# Altium schematic sheet press.SchDoc
size A4
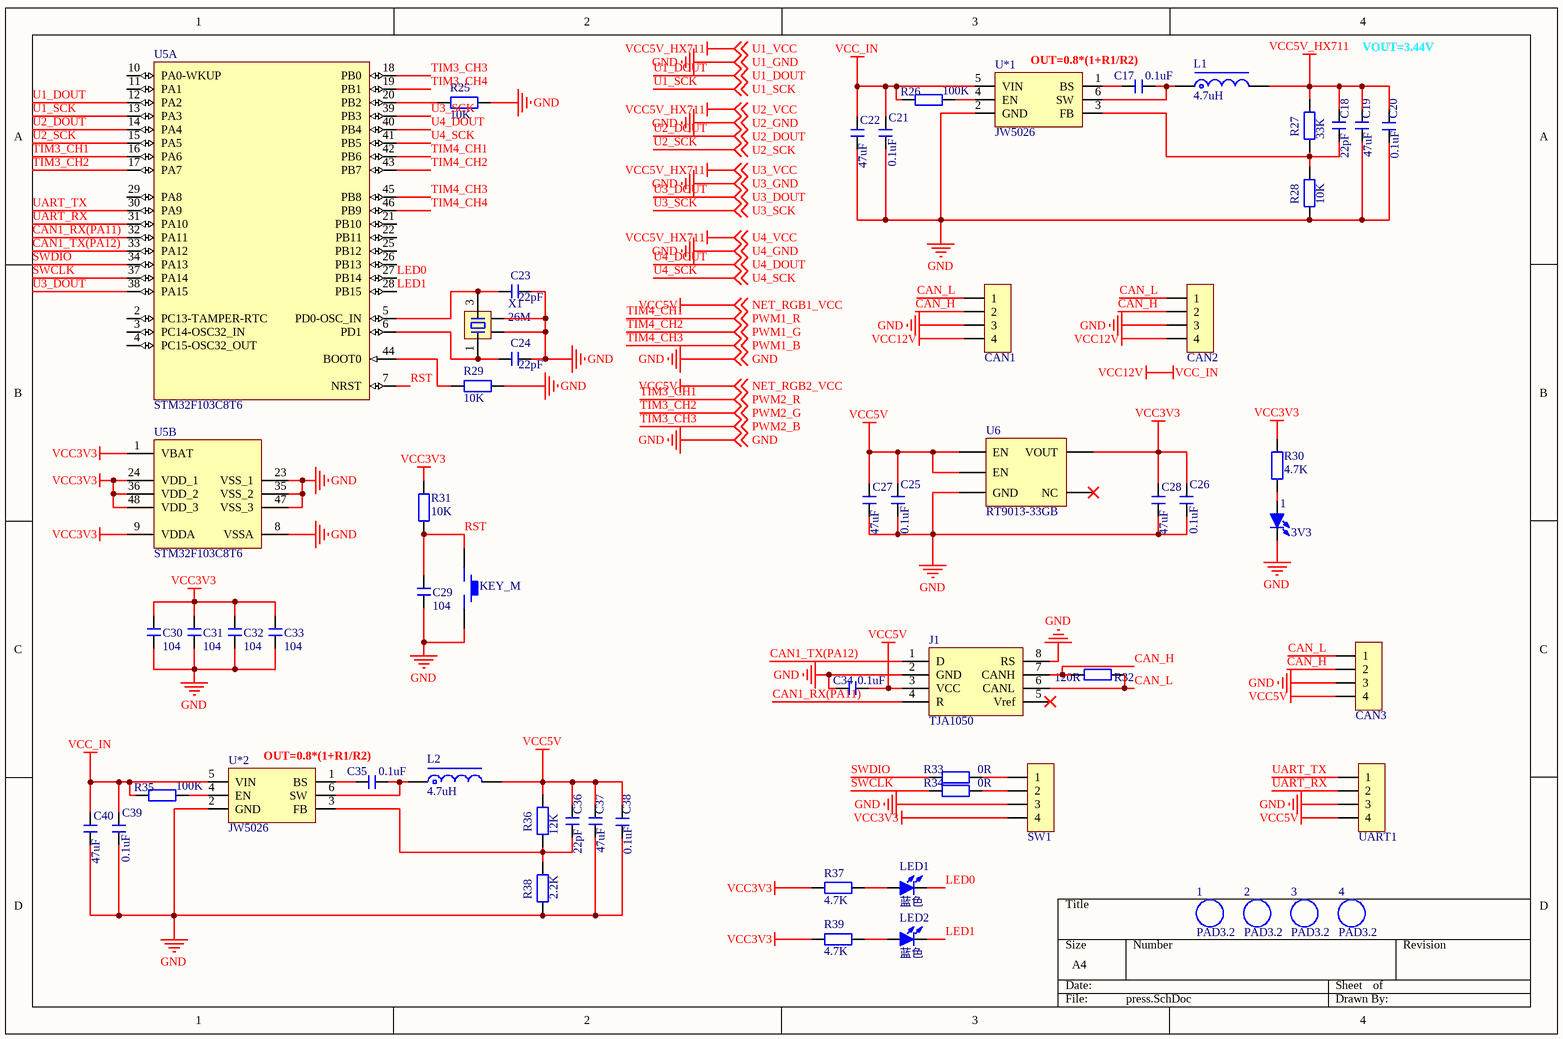
[diagram p0: press.SchDoc]

## Parts
(Parts that share a designator on the sheet are numbered #1, #2 ... from top to bottom, then left to right.)
1#1  3V3  [LED 0805R]
1#2  PAD3.2  [PAD3.2]
2  PAD3.2  [PAD3.2]
3  PAD3.2  [PAD3.2]
4  PAD3.2  [PAD3.2]
C17  0.1uF  [C 0603_L]
C18  22pF  [C 0603_L]
C19  47uF  [C 0805_L]
C20  0.1uF  [C 0805_L]
C21  0.1uF  [C 0805_L]
C22  47uF  [C 0805_L]
C23  22pF  [C 0603_L]
C24  22pF  [C 0603_L]
C25  0.1uF  [C 0805_L]
C26  0.1uF  [C 0805_L]
C27  47uF  [C 0805_L]
C28  47uF  [C 0805_L]
C29  104  [C 0603_L]
C30  104  [C 0603_L]
C31  104  [C 0603_L]
C32  104  [C 0603_L]
C33  104  [C 0603_L]
C34  0.1uF  [C 0603_L]
C35  0.1uF  [C 0603_L]
C36  22pF  [C 0603_L]
C37  47uF  [C 0805_L]
C38  0.1uF  [C 0805_L]
C39  0.1uF  [C 0805_L]
C40  47uF  [C 0805_L]
CAN1  HDR-1X4  [MX 1.25-WS-4P]  (value not drawn)
CAN2  HDR-1X4  [MX 1.25-WS-4P]  (value not drawn)
CAN3  HDR-1X4  [MX 1.25-WS-4P]  (value not drawn)
J1  TJA1050  [SOIC-8_150mil]
L1  4.7uH  [CD53]
L2  4.7uH  [CD53]
LED1  蓝色  [LED 0805B]
LED2  蓝色  [LED 0805B]
R25  10K  [R 0603_L]
R26  100K  [R 0603_L]
R27  33K  [R 0603_L]
R28  10K  [R 0603_L]
R29  10K  [R 0603_L]
R30  4.7K  [R 0603_L]
R31  10K  [R 0603_L]
R32  120R  [R 0603_L]
R33  0R  [R 0603_L]
R34  0R  [R 0603_L]
R35  100K  [R 0603_L]
R36  12K  [R 0603_L]
R37  4.7K  [R 0603_L]
R38  2.2K  [R 0603_L]
R39  4.7K  [R 0603_L]
RST1  KEY_M  [SMD-3.2*4.2]
SW1  HDR-1X4  [MX 1.25-WS-4P]  (value not drawn)
U5  STM32F103C8T6  [LQFP48_N]  (parts A,B of 2)
U6  RT9013-33GB  [SOT23-5M]
U*1  JW5026  [SOT-23-6_L2.9-W1.6-P0.95-LS2.8-BL]
U*2  JW5026  [SOT-23-6_L2.9-W1.6-P0.95-LS2.8-BL]
UART1  HDR-1X4  [MX 1.25-WS-4P]  (value not drawn)
X1  26M  [OSC 3225-4P]

## Nets
GND: 1#1.2(K) C19.1 C20.1 C21.1 C22.1 C23.2 C24.2 C25.1 C26.1 C27.1 C28.1 C29.1 C30.1 C31.1 C32.1 C33.1 C34.2 C37.1 C38.1 C39.1 C40.1 CAN1.3 CAN2.3 CAN3.3 J1.2(GND) J1.8(RS) R25.2 R28.1 R29.2 R38.1 RST1.2 SW1.3 U5.8(VSSA) U5.23(VSS_1) U5.35(VSS_2) U5.47(VSS_3) U6.2(GND) U*1.2(GND) U*2.2(GND) UART1.3 X1.2 X1.4 ; off-sheet U1_GND, off-sheet U2_GND, off-sheet U3_GND, off-sheet U4_GND, off-sheet GND  [also labelled U1_GND, U2_GND, U3_GND, U4_GND]
VCC3V3: C26.2 C28.2 C30.2 C31.2 C32.2 C33.2 R30.1 R31.2 R37.1 R39.1 SW1.4 U5.1(VBAT) U5.9(VDDA) U5.24(VDD_1) U5.36(VDD_2) U5.48(VDD_3) U6.5(VOUT)
VCC5V: C25.2 C27.2 C34.1 C36.2 C37.2 C38.2 CAN3.4 J1.3(VCC) L2.2 R36.2 U6.1(EN) U6.3(EN) UART1.4 ; off-sheet NET_RGB1_VCC, off-sheet NET_RGB2_VCC  [also labelled NET_RGB1_VCC, NET_RGB2_VCC]
VCC5V_HX711: C18.2 C19.2 C20.2 L1.2 R27.2 ; off-sheet U1_VCC, off-sheet U2_VCC, off-sheet U3_VCC, off-sheet U4_VCC  [also labelled U1_VCC, U2_VCC, U3_VCC, U4_VCC]
VCC12V: C21.2 C22.2 C39.2 C40.2 CAN1.4 CAN2.4 R26.2 R35.2 U*1.5(VIN) U*2.5(VIN)  [also labelled VCC_IN]
CAN1_RX(PA11): J1.4(R) U5.32(PA11)
CAN1_TX(PA12): J1.1(D) U5.33(PA12)
CAN_H: CAN1.2 CAN2.2 CAN3.2 J1.7(CANH) R32.1
CAN_L: CAN1.1 CAN2.1 CAN3.1 J1.6(CANL) R32.2
LED0: LED1.2(K) U5.27(PB14)
LED1: LED2.2(K) U5.28(PB15)
RST: C29.2 R31.1 RST1.1 U5.7(NRST)
SWCLK: R34.1 U5.37(PA14)
SWDIO: R33.1 U5.34(PA13)
TIM3_CH1: U5.16(PA6) ; off-sheet PWM2_R  [also labelled PWM2_R]
TIM3_CH2: U5.17(PA7) ; off-sheet PWM2_G  [also labelled PWM2_G]
TIM3_CH3: U5.18(PB0) ; off-sheet PWM2_B  [also labelled PWM2_B]
TIM3_CH4: U5.19(PB1)
TIM4_CH1: U5.42(PB6) ; off-sheet PWM1_R  [also labelled PWM1_R]
TIM4_CH2: U5.43(PB7) ; off-sheet PWM1_G  [also labelled PWM1_G]
TIM4_CH3: U5.45(PB8) ; off-sheet PWM1_B  [also labelled PWM1_B]
TIM4_CH4: U5.46(PB9)
U1_DOUT: U5.12(PA2) ; off-sheet U1_DOUT
U1_SCK: U5.13(PA3) ; off-sheet U1_SCK
U2_DOUT: U5.14(PA4) ; off-sheet U2_DOUT
U2_SCK: U5.15(PA5) ; off-sheet U2_SCK
U3_DOUT: U5.38(PA15) ; off-sheet U3_DOUT
U3_SCK: U5.39(PB3) ; off-sheet U3_SCK
U4_DOUT: U5.40(PB4) ; off-sheet U4_DOUT
U4_SCK: U5.41(PB5) ; off-sheet U4_SCK
UART_RX: U5.31(PA10) UART1.2
UART_TX: U5.30(PA9) UART1.1
Net1#1_1: 1#1.1(A) R30.2
NetC17_1: C17.1 U*1.1(BS)
NetC17_2: C17.2 L1.1 U*1.6(SW)
NetC18_1: C18.1 R27.1 R28.2 U*1.3(FB)
NetC23_1: C23.1 U5.5(PD0-OSC_IN) X1.3
NetC24_1: C24.1 U5.6(PD1) X1.1
NetC35_1: C35.1 U*2.1(BS)
NetC35_2: C35.2 L2.1 U*2.6(SW)
NetC36_1: C36.1 R36.1 R38.2 U*2.3(FB)
NetLED1_1: LED1.1(A) R37.2
NetLED2_1: LED2.1(A) R39.2
NetR25_1: R25.1 U5.20(PB2)
NetR26_1: R26.1 U*1.4(EN)
NetR29_1: R29.1 U5.44(BOOT0)
NetR33_2: R33.2 SW1.1
NetR34_2: R34.2 SW1.2
NetR35_1: R35.1 U*2.4(EN)

Not connected (* = marked no-connect by the designer): J1 5(Vref)*; U5 2(PC13-TAMPER-RTC) 3(PC14-OSC32_IN) 4(PC15-OSC32_OUT) 10(PA0-WKUP) 11(PA1) 21(PB10) 22(PB11) 25(PB12) 26(PB13) 29(PA8); U6 4(NC)*

## Notes on the sheet
- OUT=0.8*(1+R1/R2)
- VOUT=3.44V

## Library data of the parts
1#1 LED1 LED2 = LED-SMD: 贴片LED
C17-C40 = C: 贴片电容
CAN1-CAN3 SW1 UART1 = Header 4: 4P接插件
J1 = TJA1050: CAN芯片
L1 L2 = L-SMD: CD系列贴片线绕功率电感
R25-R39 = R: 贴片电阻
U5 = STM32F103C8T6: STM32 ARM-based 32-bit MCU Performance Line with 64 kB Flash, 20 kB Internal RAM, -40 to +85癈 Temperature, 48-Pin LQFP, Tray; DatasheetVersion: rev13.0, Apr-2011; PackageVersion: rev13, Apr-2011; PackageReference: LQFP48; PackageDescription: 48-Pin Low-Profile Quad Flat Pack, 7 x 7 mm Body, 0.5 mm Pitch (LQFP48); ComponentLink1Description: Manufacturer URL; ComponentLink1URL: http://www.st.com/; ComponentLink2Description: STM32F103 Datasheet; ComponentLink2URL: http://www.st.com/internet/com/TECHNICAL_RESOURCES/TECHNICAL_LITERATURE/DATASHEET/CD00161566.pdf; ComponentLink3Description: STM32 Family Web Page; ComponentLink3URL: www.st.com/stm32; 联系售后: https://shop463601444.taobao.com
U*1 U*2 = JW5026 : BUCK、MAX40V
X1 = XTAL-4P: 4脚无源晶振